# EasyEDA schematic easyeda.json
TITLE: zigpi; REV: 0.1.0; Date: 2019-09-15; Sheet: 1/1; Drawn By: kasparsd; Company: Kaspars
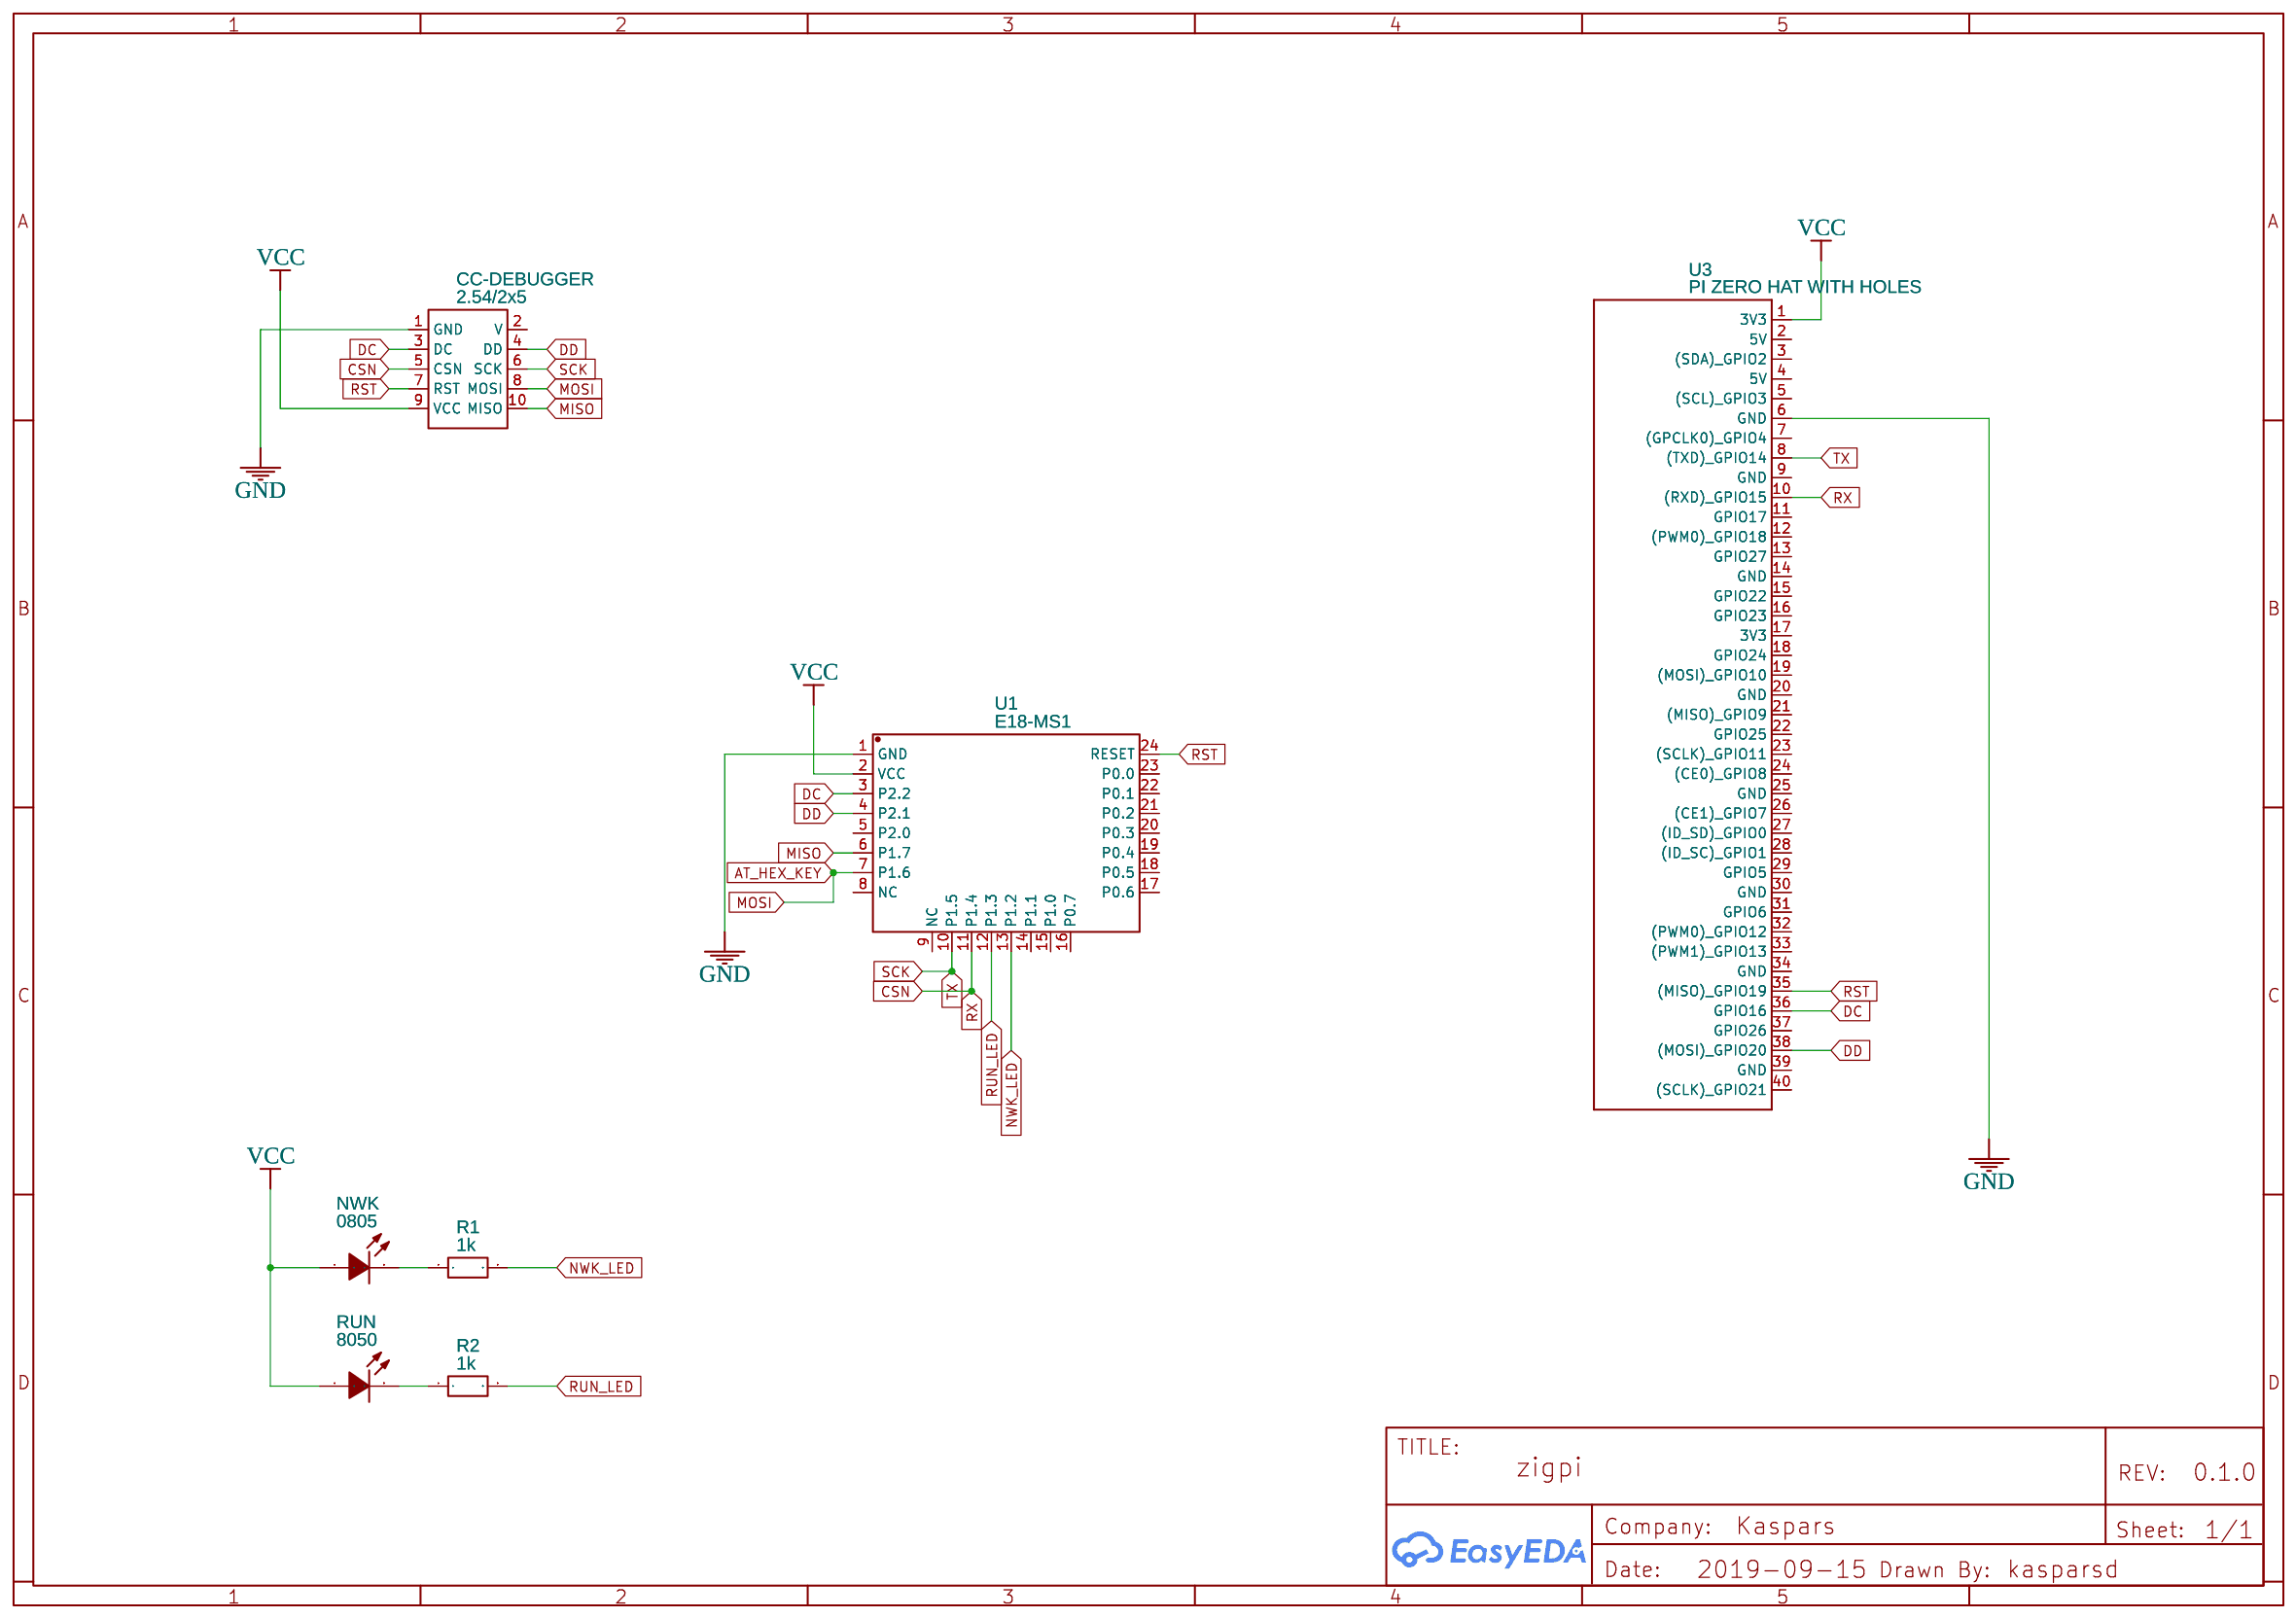
[diagram p0: schematic sheet]

## Parts
CC-DEBUGGER  2.54/2x5  [DIP-2X5P-2.54]
NWK  0805  [LED-0805]
R1  1k  [0805]
R2  1k  [0805]
RUN  8050  [LED-0805]
U1  E18-MS1  [E18-MS1-PCB-C97344]
U3  PI ZERO HAT WITH HOLES  [PI ZERO HAT WITH HOLES]

## Library data of the parts
CC-DEBUGGER = Header-Female-2.54_2x5: Supplier: LCSC; Manufacturer: Ckmtw; Manufacturer Part: 220S-2*5P H=8.5MM Ytype Gold-plated; Supplier Part: C124423
NWK RUN = D-W080508W1-KS2: Supplier: LCSC; Manufacturer: ARKLED; Contributor: LCSC; Supplier Part: C130115
R1 R2 = Res_0805(1/8W)_EU
U1 = -: Supplier: LCSC; Supplier Part: C97344; Manufacturer: Chengdu Ebyte Elec Tech; Manufacturer Part: E18-MS1-PCB; Contributor: LCSC
U3 = PI ZERO HAT WITH HOLES: Manufacturer Part: RaspberryPi 3; Contributor: Pierre Demartines

## Nets
GND: CC-DEBUGGER.1(GND) U1.1(GND) U3.6(GND)
VCC: CC-DEBUGGER.9(VCC) NWK.1(A) RUN.1(A) U1.2(VCC) U3.1(3V3)
AT_HEX_KEY: CC-DEBUGGER.8(MOSI) U1.7(P1.6)
CSN: CC-DEBUGGER.5(CSN) U1.11(P1.4) U3.10((RXD) GPIO15)
DC: CC-DEBUGGER.3(DC) U1.3(P2.2) U3.36(GPIO16)
DD: CC-DEBUGGER.4(DD) U1.4(P2.1) U3.38((MOSI) GPIO20)
MISO: CC-DEBUGGER.10(MISO) U1.6(P1.7)
NWK_LED: R1.2 U1.13(P1.2)
RST: CC-DEBUGGER.7(RST) U1.24(RESET) U3.35((MISO) GPIO19)
RUN_LED: R2.2 U1.12(P1.3)
SCK: CC-DEBUGGER.6(SCK) U1.10(P1.5) U3.8((TXD) GPIO14)
Net-(NWK-2): NWK.2(K) R1.1
Net-(R2-1): R2.1 RUN.2(K)

Not connected (* = marked no-connect by the designer): CC-DEBUGGER 2(V); U1 5(P2.0) 8(NC) 9(NC) 14(P1.1) 15(P1.0) 16(P0.7) 17(P0.6) 18(P0.5) 19(P0.4) 20(P0.3) 21(P0.2) 22(P0.1) 23(P0.0); U3 2(5V) 3((SDA) GPIO2) 4(5V) 5((SCL) GPIO3) 7((GPCLK0) GPIO4) 9(GND) 11(GPIO17) 12((PWM0) GPIO18) 13(GPIO27) 14(GND) 15(GPIO22) 16(GPIO23) 17(3V3) 18(GPIO24) 19((MOSI) GPIO10) 20(GND) 21((MISO) GPIO9) 22(GPIO25) 23((SCLK) GPIO11) 24((CE0) GPIO8) 25(GND) 26((CE1) GPIO7) 27((ID_SD) GPIO0) 28((ID_SC) GPIO1) 29(GPIO5) 30(GND) 31(GPIO6) 32((PWM0) GPIO12) 33((PWM1) GPIO13) 34(GND) 37(GPIO26) 39(GND) 40((SCLK) GPIO21)
